# Altium schematic sheet QSFP_Connectors.SchDoc: QSFP+ Connectors & Filtering
size B; CheckedBy: Jason Sullins; Author: Jordan Harris-Toovy; Revision: 0.2; SheetNumber: 7; SheetTotal: 22; Size: ANSI B
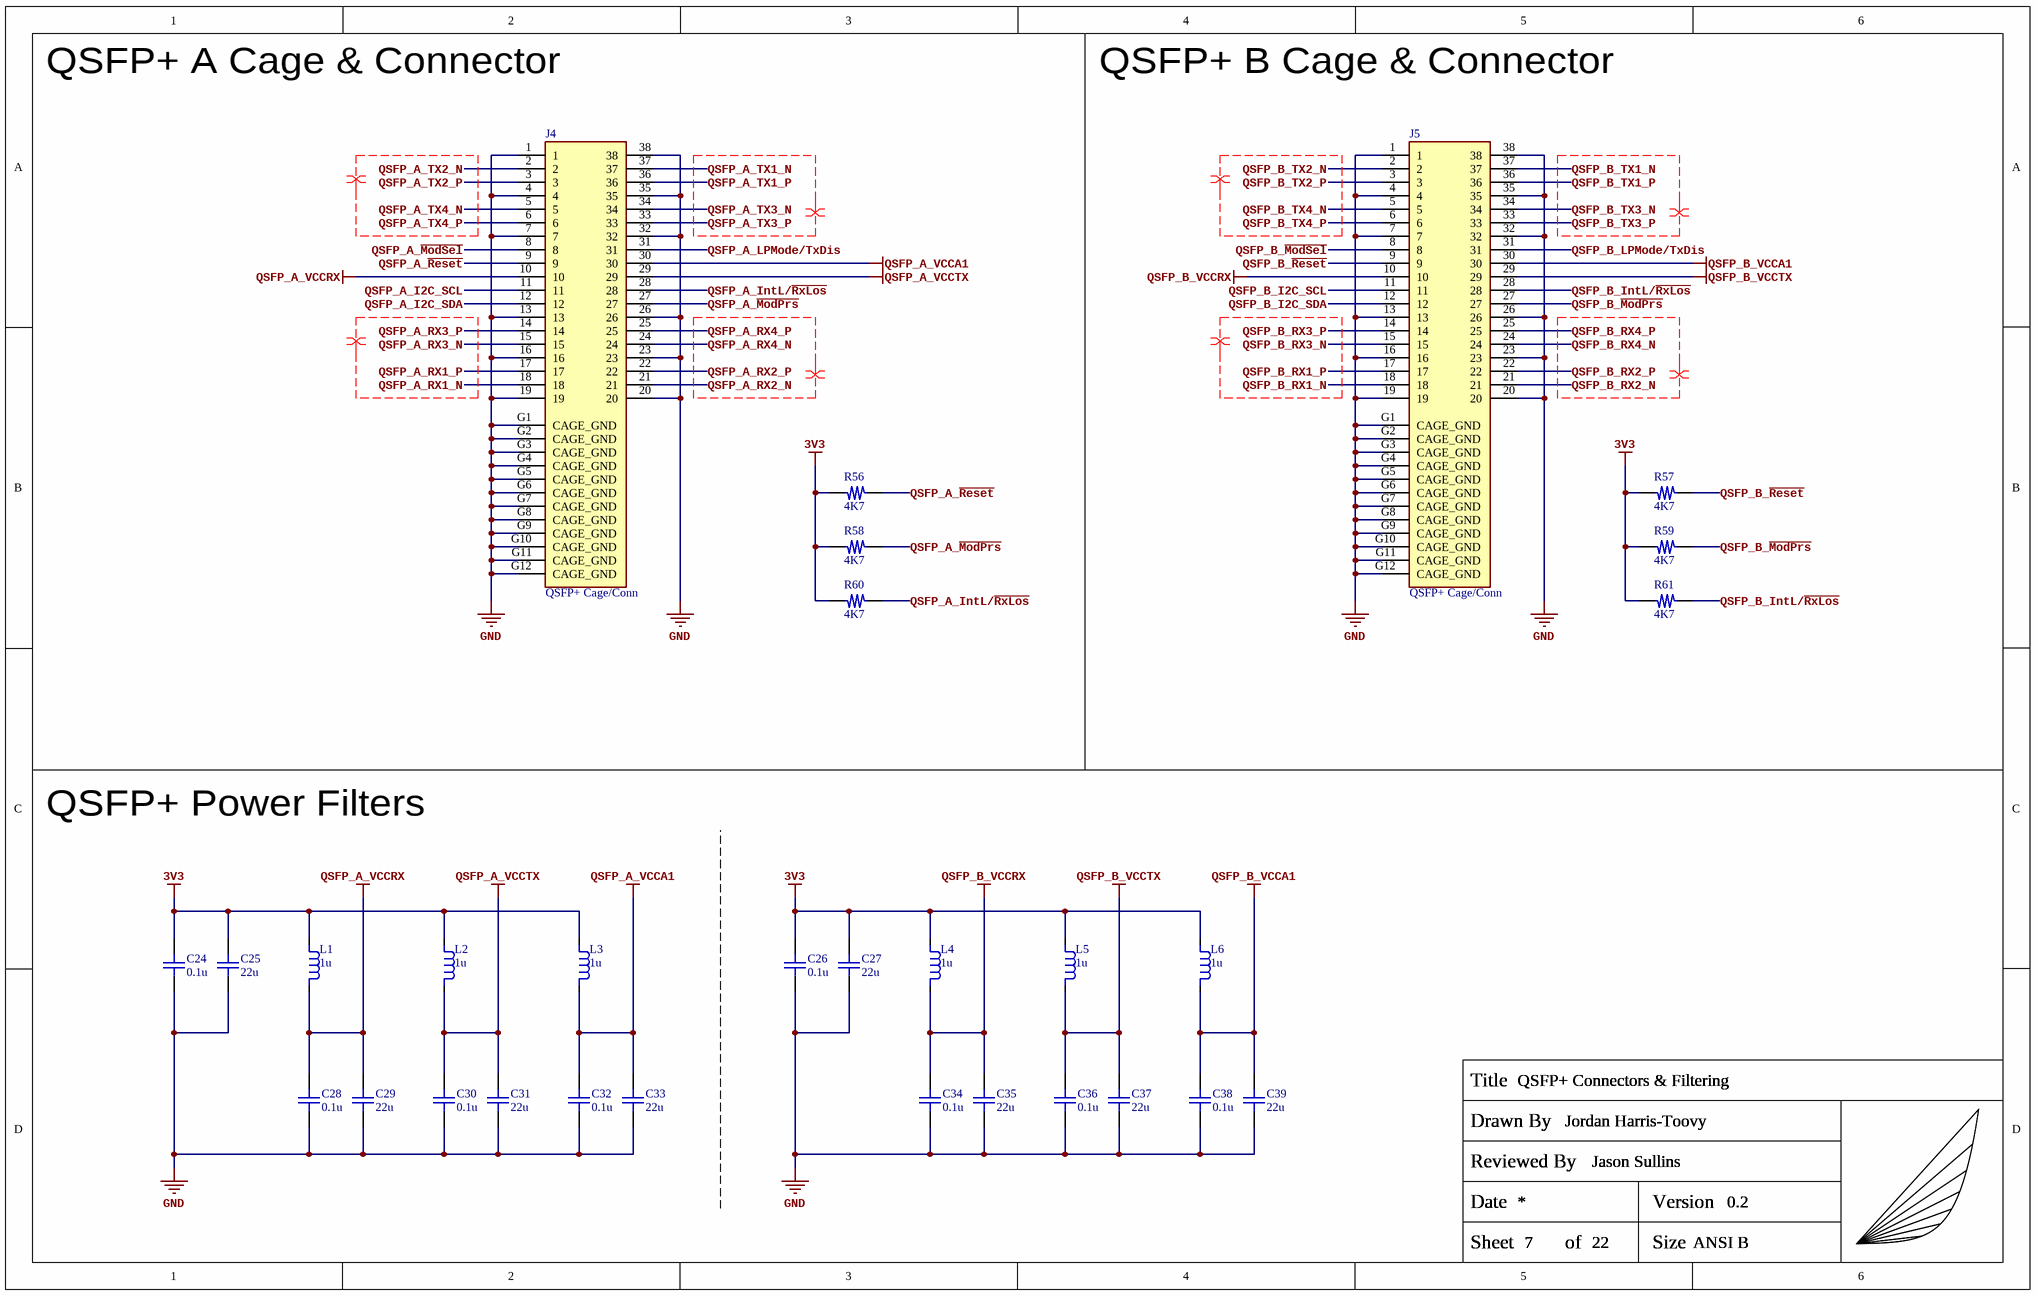
[diagram p0: QSFP_Connectors.SchDoc]

## Parts
C24  0.1u  [C_0402_Generic]
C25  22u  [C_0603_Generic]
C26  0.1u  [C_0402_Generic]
C27  22u  [C_0603_Generic]
C28  0.1u  [C_0402_Generic]
C29  22u  [C_0603_Generic]
C30  0.1u  [C_0402_Generic]
C31  22u  [C_0603_Generic]
C32  0.1u  [C_0402_Generic]
C33  22u  [C_0603_Generic]
C34  0.1u  [C_0402_Generic]
C35  22u  [C_0603_Generic]
C36  0.1u  [C_0402_Generic]
C37  22u  [C_0603_Generic]
C38  0.1u  [C_0402_Generic]
C39  22u  [C_0603_Generic]
J4  QSFP+ Cage/Conn  [AMPHENOL_U95T151100A]
J5  QSFP+ Cage/Conn  [AMPHENOL_U95T151100A]
L1  1u  [Murata_Ind_1008]
L2  1u  [Murata_Ind_1008]
L3  1u  [Murata_Ind_1008]
L4  1u  [Murata_Ind_1008]
L5  1u  [Murata_Ind_1008]
L6  1u  [Murata_Ind_1008]
R56  4K7  [R_0402_Generic]
R57  4K7  [R_0402_Generic]
R58  4K7  [R_0402_Generic]
R59  4K7  [R_0402_Generic]
R60  4K7  [R_0402_Generic]
R61  4K7  [R_0402_Generic]
TITLEBLOCK?  Capstone_Title_Block  (value not drawn)  (graphical)

## Nets
3V3: C24.2 C25.2 C26.2 C27.2 L1.2 L2.2 L3.2 L4.2 L5.2 L6.2 R56.2 R57.2 R58.2 R59.2 R60.2 R61.2
GND: C24.1 C25.1 C26.1 C27.1 C28.1 C29.1 C30.1 C31.1 C32.1 C33.1 C34.1 C35.1 C36.1 C37.1 C38.1 C39.1 J4.1 J4.4 J4.7 J4.13 J4.16 J4.19 J4.20 J4.23 J4.26 J4.32 J4.35 J4.38 J4.G1(CAGE_GND) J4.G2(CAGE_GND) J4.G3(CAGE_GND) J4.G4(CAGE_GND) J4.G5(CAGE_GND) J4.G6(CAGE_GND) J4.G7(CAGE_GND) J4.G8(CAGE_GND) J4.G9(CAGE_GND) J4.G10(CAGE_GND) J4.G11(CAGE_GND) J4.G12(CAGE_GND) J5.1 J5.4 J5.7 J5.13 J5.16 J5.19 J5.20 J5.23 J5.26 J5.32 J5.35 J5.38 J5.G1(CAGE_GND) J5.G2(CAGE_GND) J5.G3(CAGE_GND) J5.G4(CAGE_GND) J5.G5(CAGE_GND) J5.G6(CAGE_GND) J5.G7(CAGE_GND) J5.G8(CAGE_GND) J5.G9(CAGE_GND) J5.G10(CAGE_GND) J5.G11(CAGE_GND) J5.G12(CAGE_GND)
QSFP_A_VCCA1: C32.2 C33.2 J4.30 L3.1
QSFP_A_VCCRX: C28.2 C29.2 J4.10 L1.1
QSFP_A_VCCTX: C30.2 C31.2 J4.29 L2.1
QSFP_B_VCCA1: C38.2 C39.2 J5.30 L6.1
QSFP_B_VCCRX: C34.2 C35.2 J5.10 L4.1
QSFP_B_VCCTX: C36.2 C37.2 J5.29 L5.1
QSFP_A_I2C_SCL: J4.11
QSFP_A_I2C_SDA: J4.12
QSFP_A_IntL/~{RxLos}: J4.28 R60.1
QSFP_A_LPMode/TxDis: J4.31
QSFP_A_~{ModPrs}: J4.27 R58.1
QSFP_A_~{ModSel}: J4.8
QSFP_A_~{Reset}: J4.9 R56.1
QSFP_A_RX1_N: J4.18
QSFP_A_RX1_P: J4.17
QSFP_A_RX2_N: J4.21
QSFP_A_RX2_P: J4.22
QSFP_A_RX3_N: J4.15
QSFP_A_RX3_P: J4.14
QSFP_A_RX4_N: J4.24
QSFP_A_RX4_P: J4.25
QSFP_A_TX1_N: J4.37
QSFP_A_TX1_P: J4.36
QSFP_A_TX2_N: J4.2
QSFP_A_TX2_P: J4.3
QSFP_A_TX3_N: J4.34
QSFP_A_TX3_P: J4.33
QSFP_A_TX4_N: J4.5
QSFP_A_TX4_P: J4.6
QSFP_B_I2C_SCL: J5.11
QSFP_B_I2C_SDA: J5.12
QSFP_B_IntL/~{RxLos}: J5.28 R61.1
QSFP_B_LPMode/TxDis: J5.31
QSFP_B_~{ModPrs}: J5.27 R59.1
QSFP_B_~{ModSel}: J5.8
QSFP_B_~{Reset}: J5.9 R57.1
QSFP_B_RX1_N: J5.18
QSFP_B_RX1_P: J5.17
QSFP_B_RX2_N: J5.21
QSFP_B_RX2_P: J5.22
QSFP_B_RX3_N: J5.15
QSFP_B_RX3_P: J5.14
QSFP_B_RX4_N: J5.24
QSFP_B_RX4_P: J5.25
QSFP_B_TX1_N: J5.37
QSFP_B_TX1_P: J5.36
QSFP_B_TX2_N: J5.2
QSFP_B_TX2_P: J5.3
QSFP_B_TX3_N: J5.34
QSFP_B_TX3_P: J5.33
QSFP_B_TX4_N: J5.5
QSFP_B_TX4_P: J5.6

## Layout directives
differential pair; differential pair class DP100_QSFP: QSFP_A_RX1_N, QSFP_A_RX1_P, QSFP_A_RX2_N, QSFP_A_RX2_P, QSFP_A_RX3_N, QSFP_A_RX3_P, QSFP_A_RX4_N, QSFP_A_RX4_P, QSFP_A_TX1_N, QSFP_A_TX1_P, QSFP_A_TX2_N, QSFP_A_TX2_P, QSFP_A_TX3_N, QSFP_A_TX3_P, QSFP_A_TX4_N, QSFP_A_TX4_P, QSFP_B_RX1_N, QSFP_B_RX1_P, QSFP_B_RX2_N, QSFP_B_RX2_P, QSFP_B_RX3_N, QSFP_B_RX3_P, QSFP_B_RX4_N, QSFP_B_RX4_P, QSFP_B_TX1_N, QSFP_B_TX1_P, QSFP_B_TX2_N, QSFP_B_TX2_P, QSFP_B_TX3_N, QSFP_B_TX3_P, QSFP_B_TX4_N, QSFP_B_TX4_P

## Notes on the sheet
- QSFP+ A Cage & Connector
- QSFP+ B Cage & Connector
- QSFP+ Power Filters
- (in symbol Capstone_Title_Block) Title; Drawn By; Reviewed By; Date; Version; Sheet; of; Size

## Library data of the parts
C24 C26 C28 C30 C32 C34 C36 C38 = GRM155R71C104KA88D: 0.1µF 16V X7R SMD ceramic capacitor in 0402 size; Manufacturer: Murata Electronics; Manufacturer Part Number: GRM155R71C104KA88D
C25 C27 C29 C31 C33 C35 C37 C39 = GRM188R60J226MEA0D: 22µF 6.3V X5R SMD ceramic capacitor in 0603 size; Manufacturer: Murata Electronics; Manufacturer Part Number: GRM188R60J226MEA0D
J4 J5 = U95T151100A_FS1-Z38-20Z6-6: Amphenol 38 Position QSFP+ receptacle and cage; Manufacturer: Amphenol ICC; Manufacturer Part Number: U95-T151-100A; Manufacturer2 Part Number: FS1-Z38-20Z6-60; Manufacturer2: Amphenol ICC
L1-L6 = DFE252012F-1R0M=P2: 1µH Shielded 3.3A 40mOhm 1008 Inductor; Manufacturer: Murata Electronics; Manufacturer Part Number: DFE252012F-1R0M=P2
R56-R61 = ERJ-2RKF4701X: 4.7KOhm 1% 1/10W SMD resistor in 0402 size; Manufacturer: Panasonic; Manufacturer Part Number: ERJ-2RKF4701X
TITLEBLOCK? = Capstone_Title_Block: Custom title block with personal logo; Manufacturer: NONE; Manufacturer Part Number: NONE